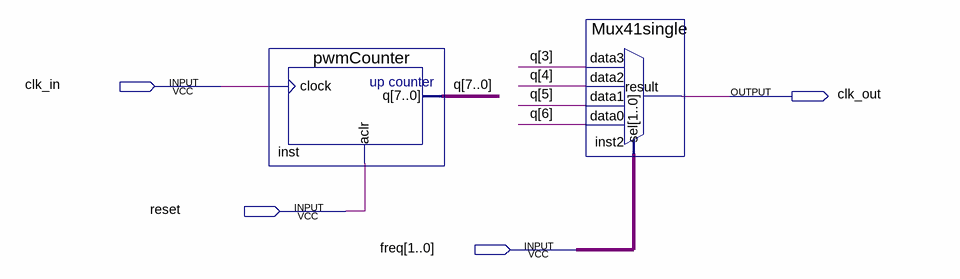
[diagram p0: schematic sheet]
// Quartus schematic FreqSel.bdf as structural Verilog: 2 symbols, 4 pins
module FreqSel (
  input  clk_in,
  input  reset,
  input  [1:0] freq,
  output clk_out
);

  wire [7:0] q;

  pwmCounter inst (.clock(clk_in), .aclr(reset), .q(q));
  Mux41single inst2 (.data3(q[3]), .data2(q[4]), .data1(q[5]), .data0(q[6]), .sel(freq), .result(clk_out));
endmodule
